# Altium schematic sheet Senor_Moist.SchDoc: ZStation Sensor Moist
size A4; Engineer: Stephan Eersels; DocumentNumber: 12202925_ZS; Revision: 2.1; SheetNumber: 5; SheetTotal: 8